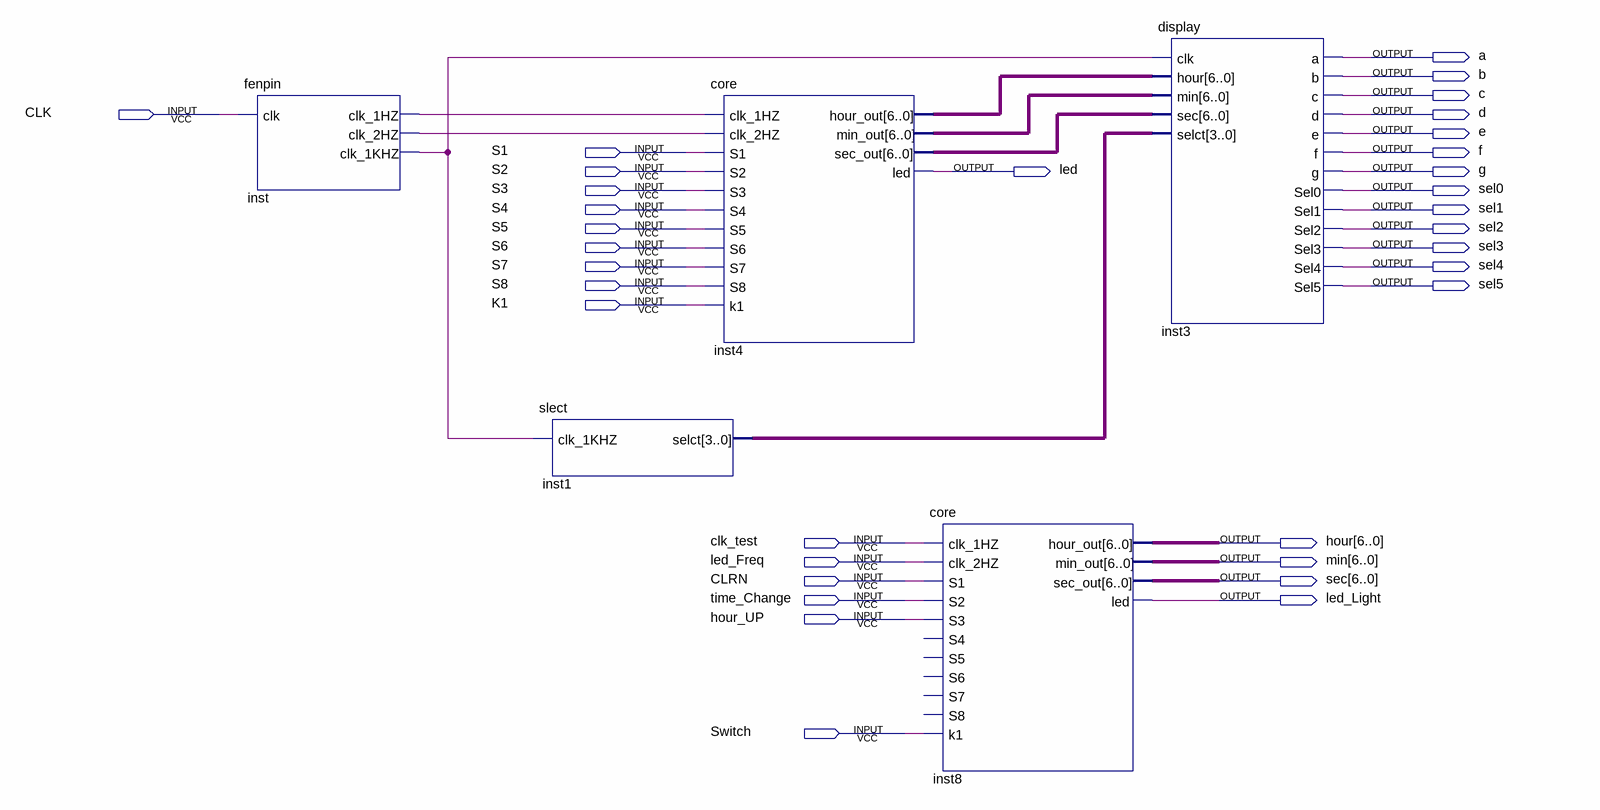
[diagram p0: schematic sheet]
// Quartus schematic DigitalClock.bdf as structural Verilog: 5 symbols, 34 pins
module DigitalClock (
  input  CLK,
  input  S1,
  input  S2,
  input  S3,
  input  S4,
  input  S5,
  input  S6,
  input  S7,
  input  S8,
  input  K1,
  input  clk_test,
  input  led_Freq,
  input  CLRN,
  input  time_Change,
  input  hour_UP,
  input  Switch,
  output a,
  output b,
  output c,
  output d,
  output e,
  output f,
  output led,
  output g,
  output sel0,
  output sel1,
  output sel2,
  output sel3,
  output sel4,
  output sel5,
  output [6:0] hour,
  output [6:0] min,
  output [6:0] sec,
  output led_Light
);

  wire inst_clk_1hz, inst_clk_1khz, inst_clk_2hz;
  wire [3:0] inst1_selct;
  wire [6:0] inst4_hour_out, inst4_min_out, inst4_sec_out;

  fenpin inst (.clk(CLK), .clk_1HZ(inst_clk_1hz), .clk_2HZ(inst_clk_2hz), .clk_1KHZ(inst_clk_1khz));
  slect inst1 (.clk_1KHZ(inst_clk_1khz), .selct(inst1_selct));
  core inst4 (
    .clk_1HZ(inst_clk_1hz), .clk_2HZ(inst_clk_2hz), .S1(S1), .S2(S2), .S3(S3), .S4(S4), .S5(S5), .S6(S6),
    .S7(S7), .S8(S8), .k1(K1), .hour_out(inst4_hour_out), .min_out(inst4_min_out), .sec_out(inst4_sec_out),
    .led(led));
  core inst8 (
    .clk_1HZ(clk_test), .clk_2HZ(led_Freq), .S1(CLRN), .S2(time_Change), .S3(hour_UP), .k1(Switch),
    .hour_out(hour), .min_out(min), .sec_out(sec), .led(led_Light));  // open: S4, S5, S6, S7, S8
  display inst3 (
    .clk(inst_clk_1khz), .hour(inst4_hour_out), .min(inst4_min_out), .sec(inst4_sec_out),
    .selct(inst1_selct), .a(a), .b(b), .c(c), .d(d), .e(e), .f(f), .g(g), .Sel0(sel0), .Sel1(sel1),
    .Sel2(sel2), .Sel3(sel3), .Sel4(sel4), .Sel5(sel5));
endmodule
